# Altium project Button_Module.PrjPcb
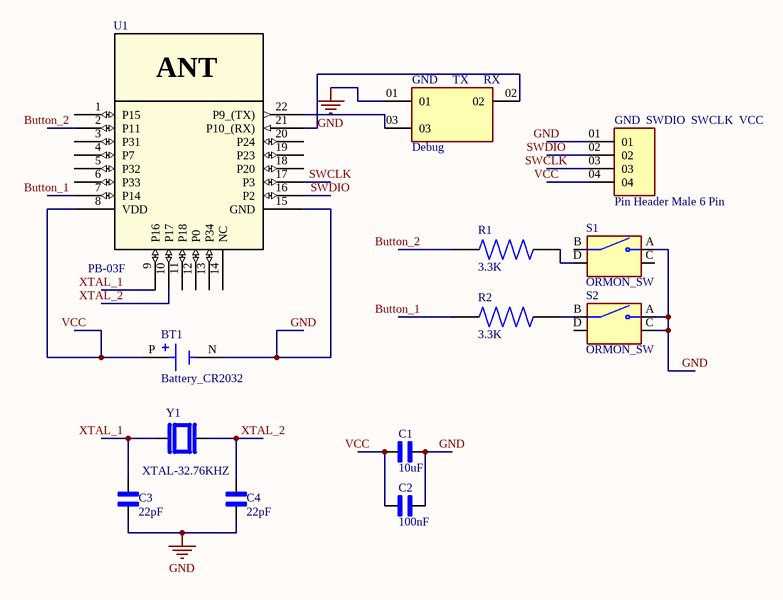
[diagram p0: Button_Module.SchDoc]
1 sheet, 13 parts. Net scope: global (net labels, ports and power ports of the same name join across sheets).
Board file: Button_Module.PcbDoc

## Sheet Button_Module.SchDoc
size A4; SheetNumber: 1; SheetTotal: 1

### Parts
BT1  Battery_CR2032  [BAT_1066]
C1  10uF  [22pF_Cap_0603]
C2  100nF  [22pF_Cap_0603]
C3  22pF  [22pF_Cap_0603]
C4  22pF  [22pF_Cap_0603]
GND_SWDIO_SWCLK_VCC  Pin Header Male 6 Pin  [Prog]
GND_TX_RX  Debug  [Debug]
R1  3.3K  [Resistor_0805]
R2  3.3K  [Resistor_0805]
S1  ORMON_SW  [ORMON_SW]
S2  ORMON_SW  [ORMON_SW]
U1  PB-03F  [PB-03F]
Y1  XTAL-32.76KHZ  [XTAL_32.768KHZ]

### Nets
GND: BT1.N(NEG) C1.2 C2.2 C3.2 C4.2 GND_SWDIO_SWCLK_VCC.01 GND_TX_RX.01 S1.A S2.A S2.C U1.15(GND)
Button_1: R2.1 U1.7(P14)
Button_2: R1.1 U1.2(P11)
SWCLK: GND_SWDIO_SWCLK_VCC.03 U1.17(P3)
SWDIO: GND_SWDIO_SWCLK_VCC.02 U1.16(P2)
VCC: BT1.P(POS) C1.1 C2.1 GND_SWDIO_SWCLK_VCC.04 U1.8(VDD)
XTAL_1: C3.1 U1.9(P16) Y1.2
XTAL_2: C4.1 U1.10(P17) Y1.1
NetGND_TX_RX_02: GND_TX_RX.02 U1.21(P10_(RX))
NetGND_TX_RX_03: GND_TX_RX.03 U1.22(P9_(TX))
NetR1_2: R1.2 S1.D
NetR2_2: R2.2 S2.B

Not connected (* = marked no-connect by the designer): S1 B(1) C(2); S2 D(1); U1 1(P15) 3(P31) 4(P7) 5(P32) 6(P33) 11(P18) 12(P0) 13(P34) 14(NC) 18(P20) 19(P23) 20(P24)

### Notes on the sheet
- (in symbol PB-03F) ANT

### Library data of the parts
BT1 = Battery_CR2032: THM Holder for 20mm Cell-Top Loading; MF: Keystone Electronics; MP: 1066; SnapEDA_Link: https://www.snapeda.com/parts/1066/Keystone/view-part/?ref=snap; Package: None; Value: *; Check_prices: https://www.snapeda.com/parts/1066/Keystone/view-part/?ref=eda
C1-C4 = CC0603JPNPO9BN220: 22 pF Â±5% 50V Ceramic Capacitor C0G, NP0 0603 (1608 Metric); MF: Yageo; SnapEDA_Link: https://www.snapeda.com/parts/CC0603JPNPO9BN220/Yageo/view-part/?ref=snap; Package: 0603 Yageo; Value: *; MP: CC0603JPNPO9BN220; Check_prices: https://www.snapeda.com/parts/CC0603JPNPO9BN220/Yageo/view-part/?ref=eda
GND_SWDIO_SWCLK_VCC = Pin Header Male 6 Pin: MP: MTSW-106-24-G-S-300; Value: *; Availability: Unavailable; Package: None; Price: None
GND_TX_RX = Debug: MP: TSW-101-23-L-T; Package: None; Price: None; Value: *; Availability: Unavailable
R1 R2 = Resistor_0805: Res 0805 330R 5% 125mW | Bourns CR0805-JW-331ELF; SnapEDA_Link: https://www.snapeda.com/parts/CR0805-JW-331ELF/Bourns/view-part/?ref=snap; Package: 0805 Bourns; Value: *; MF: Bourns; MP: CR0805-JW-331ELF; Check_prices: https://www.snapeda.com/parts/CR0805-JW-331ELF/Bourns/view-part/?ref=eda
S1 S2 = ORMON_SW: Tactile Push Button Switch Momentary; MF: Omten Electronics; MP: TSD1265; SnapEDA_Link: https://www.snapeda.com/parts/TSD1265/Omten+Electronics/view-part/?ref=snap; Package: Package; Value: *; Check_prices: https://www.snapeda.com/parts/TSD1265/Omten+Electronics/view-part/?ref=eda
U1 = PB-03F: Description; Manufacturer_Name: Ai-Thinker; Type: RF; Copyright: Copyright (C) 2025 Ultra Librarian. All rights reserved.; Manufacturer_Part_Number: PB-03F; RefDes: RefDes
Y1 = XTAL-32.76KHZ: CRYSTAL 32.7680KHZ 12.5PF TH; MF: Abracon; MP: AB26TRB-32.76KHZ; Package: Cylindrical Can Radial  Abracon; Price: None; Value: *; SnapEDA_Link: https://www.snapeda.com/parts/AB26TRB-32.76KHZ/Abracon/view-part/?ref=snap; Availability: Not in stock; Check_prices: https://www.snapeda.com/parts/AB26TRB-32.76KHZ/Abracon/view-part/?ref=eda